# EAGLE design headphone_amp_smd (EAGLE 7.5.0)
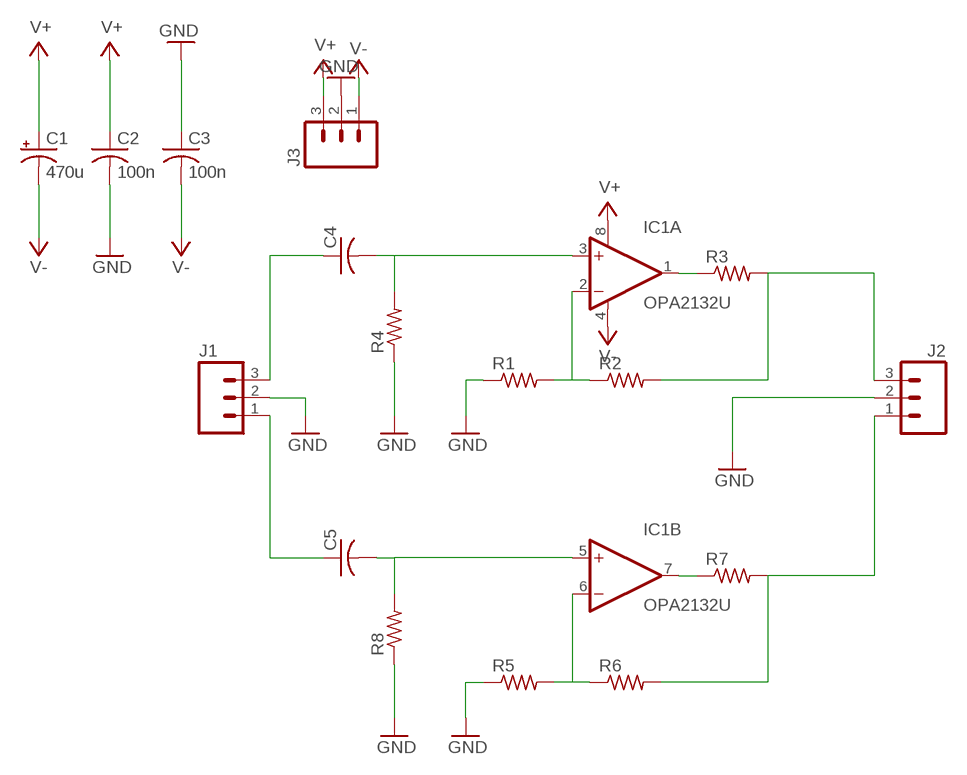
[diagram p0: schematic, sheet 1]

## Parts
C1  470u  CPOL-USE5-10.5  [E5-10,5]
C2  100n  C-USC0805K  [C0805K]
C3  100n  C-USC0805K  [C0805K]
C4  C-US025_050-035X075  [C025_050-035X075]
C5  C-US025_050-035X075  [C025_050-035X075]
IC1  OPA2132U  [SO08]
J1  M03PTH  [1X03]
J2  M03PTH  [1X03]
J3  M03PTH  [1X03]
R1  R-US_R1206  [R1206]
R2  R-US_R1206  [R1206]
R3  R-US_R1206  [R1206]
R4  R-US_R1206  [R1206]
R5  R-US_R1206  [R1206]
R6  R-US_R1206  [R1206]
R7  R-US_R1206  [R1206]
R8  R-US_R1206  [R1206]

## Nets
GND: C2.2 C3.1 J1.2 J2.2 J3.2 R1.1 R4.1 R5.1 R8.1
N$1: IC1.1(A:OUT) R3.1
N$2: J2.3 R2.2 R3.2
N$3: IC1.2(A:-IN) R1.2 R2.1
N$4: C4.1 J1.3
N$5: C4.2 IC1.3(A:+IN) R4.2
N$6: IC1.7(B:OUT) R7.1
N$7: J2.1 R6.2 R7.2
N$8: IC1.6(B:-IN) R5.2 R6.1
N$9: C5.2 IC1.5(B:+IN) R8.2
N$10: C5.1 J1.1
V+: C1.+ C2.1 IC1.8(A:V+) J3.3
V-: C1.- C3.2 IC1.4(A:V-) J3.1

## Library data of the parts
C1 = rcl:CPOL-US: POLARIZED CAPACITOR, American symbol
C2-C5 = rcl:C-US: CAPACITOR, American symbol
IC1 = burr-brown:OPA2132: High Speed FET-Input Operational Amplifiers< Product Folder:OPA2132; MF: TEXAS INSTRUMENTS; MPN: OPA2132U; OC_FARNELL: 1206934; OC_NEWARK: 80K6015
J1-J3 = SparkFun-Connectors:M03: Header 3 Standard 3-pin 0.1" header. Use with straight break away headers (SKU : PRT-00116), right angle break away headers (PRT-00553), swiss pins (PRT-00743), machine pins (PRT-00117), and female headers (PRT-00115). Molex polarized connector foot print use with SKU : PRT-08232 with associated crimp pins and housings.
R1-R8 = rcl:R-US_: RESISTOR, American symbol

## Board
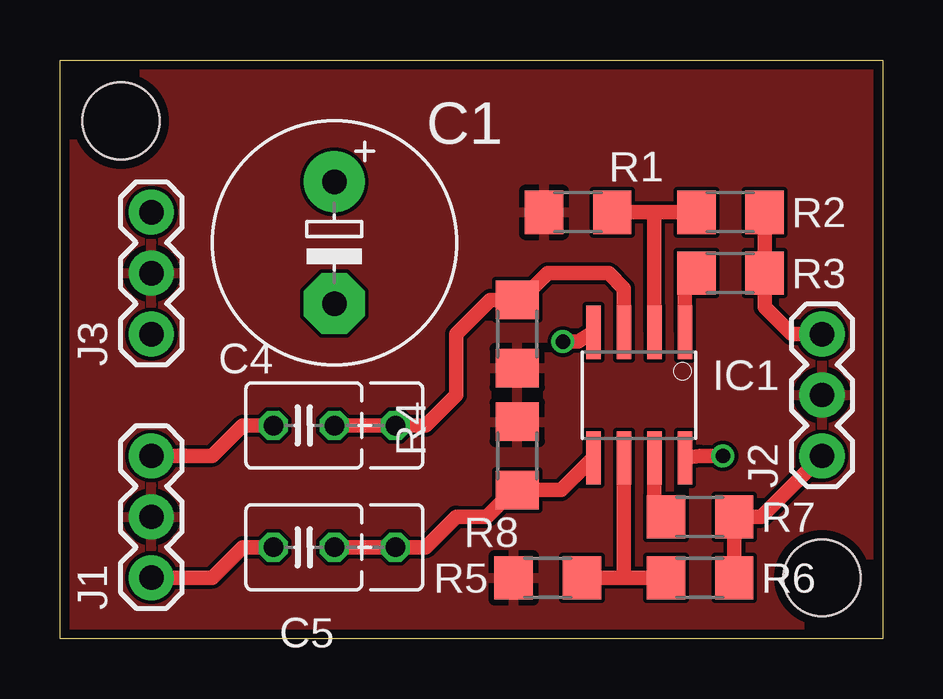
[diagram p1: board, top side]
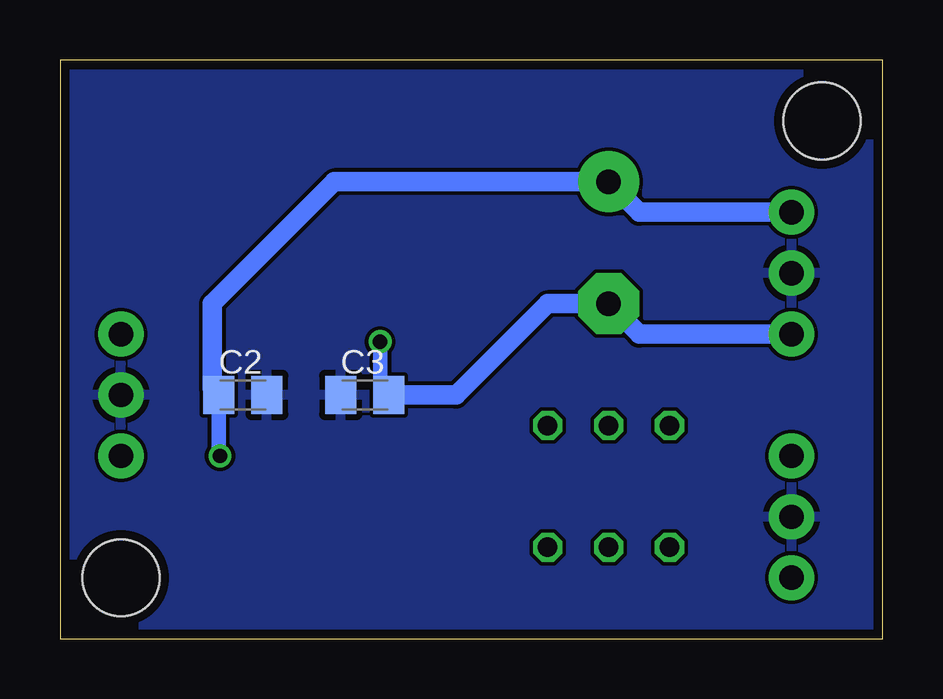
[diagram p2: board, bottom side, seen from below]

Size 34.29 x 24.13 mm. Coordinates in mm from the lower left corner, seen from the top.
Outline: 0,0 0,24.13 34.29,24.13 34.29,0 0,0
Copper layers (1*16): Top 0.0356mm / dielectric 1.5011mm / Bottom 0.0356mm
Design rules "LaenPCBOrder *": minimum track width 6mil, minimum drill 13mil, track to track 6mil, track to pad 6mil, pad to pad 6mil, via to via 6mil, smd to smd 6mil, copper to edge 15mil, drill to drill 6mil, minimum pad ring 7mil, minimum via ring 7mil, stop-mask expansion 3mil, vias tented up to drill 0mil, thermal gap 10mil
Holes 3.2 mm at 2.54,21.59 31.75,2.54

### Footprints (pad centres in the part's own frame; a part is rotated, then mirrored left to right if it is on the bottom)
E5-10,5 = drill 1.016 pad 2.54: + -2.54,0 | drill 1.016 pad 2.54 octagon: - 2.54,0
C0805K = smd 1.3 x 1.6: 1 -1,0; 2 1,0
C025_050-035X075 = drill 0.813 octagon: 1 -1.27,0; 2 1.27,0; 3 3.81,0
SO08 = smd 0.61 x 2.21: 1 -1.905,-2.616; 2 -0.635,-2.616; 3 0.635,-2.616; 4 1.905,-2.616; 5 1.905,2.616; 6 0.635,2.616; 7 -0.635,2.616; 8 -1.905,2.616
1X03 = drill 1.016 pad 1.88: 1 0,0; 2 2.54,0; 3 5.08,0
R1206 = smd 1.6 x 1.803: 1 -1.422,0; 2 1.422,0

### Placement (x,y rotation side)
C1  11.43,16.51 270 top
C2  26.67,10.16 0 bottom
C3  21.59,10.16 0 bottom
C4  10.16,8.89 0 top
C5  10.16,3.81 0 top
IC1  24.13,10.16 180 top
J1  3.81,2.54 90 top
J2  31.75,7.62 90 top
J3  3.81,12.7 90 top
R1  21.59,17.78 0 top
R2  27.94,17.78 0 top
R3  27.94,15.24 0 top
R4  19.05,12.7 90 top
R5  20.32,2.54 0 top
R6  26.67,2.54 0 top
R7  26.67,5.08 0 top
R8  19.05,7.62 270 top

### Tracks (layer width: path | path; a pad name or v marks a point on that pad's centre or on a via)
GND
  pour Top: 0,49.53 53.34,49.53 53.34,0 0,0
  pour Bottom: 0,49.53 53.34,49.53 53.34,0 0,0
N$1
  Top 0.61: IC1.1 26.04,15.24 R3.1
N$2
  Top 0.61: R2.2 R3.2 29.36,13.82 30.48,12.7 J2.3
N$3
  Top 0.61: R1.2 24.77,17.78 | 24.77,17.78 R2.1 | IC1.2 24.77,17.78
N$4
  Top 0.61: J1.3 6.35,7.62 7.62,8.89 C4.1
N$5
  Top 0.61: IC1.3 23.5,14.61 22.86,15.24 20.32,15.24 19.2,14.12 R4.2 17.93,14.12 16.51,12.7 16.51,10.16 15.24,8.89 C4.2
N$6
  Top 0.61: IC1.7 24.77,5.4 R7.1
N$7
  Top 0.61: R6.2 R7.2 29.21,5.08 J2.1
N$8
  Top 0.61: IC1.6 23.5,2.54 R5.2 R6.1
N$9
  Top 0.61: IC1.5 20.88,6.2 R8.2 18.9,6.2 17.78,5.08 16.51,5.08 15.24,3.81 C5.2
N$10
  Top 0.61: J1.1 6.35,2.54 7.62,3.81 C5.1
V+  (via drill 0.6)
  Top 0.61: 26.04,7.3 IC1.8 26.67,7.62 v27.62,7.62
  Bottom 0.61: v27.62,7.62 27.67,7.67 C2.1
  Bottom 0.813: C2.1 27.94,10.43 27.94,13.97 22.86,19.05 C1.+ 10.16,17.78 J3.3
V-  (via drill 0.6)
  Top 0.61: IC1.4 21.59,12.38 v20.95,12.38
  Bottom 0.61: v20.95,12.38 20.95,10.48 C3.2
  Bottom 0.813: C3.2 17.78,10.16 13.97,13.97 C1.- 10.16,12.7 J3.1